# Altium schematic sheet Sheet1.SchDoc
size A4
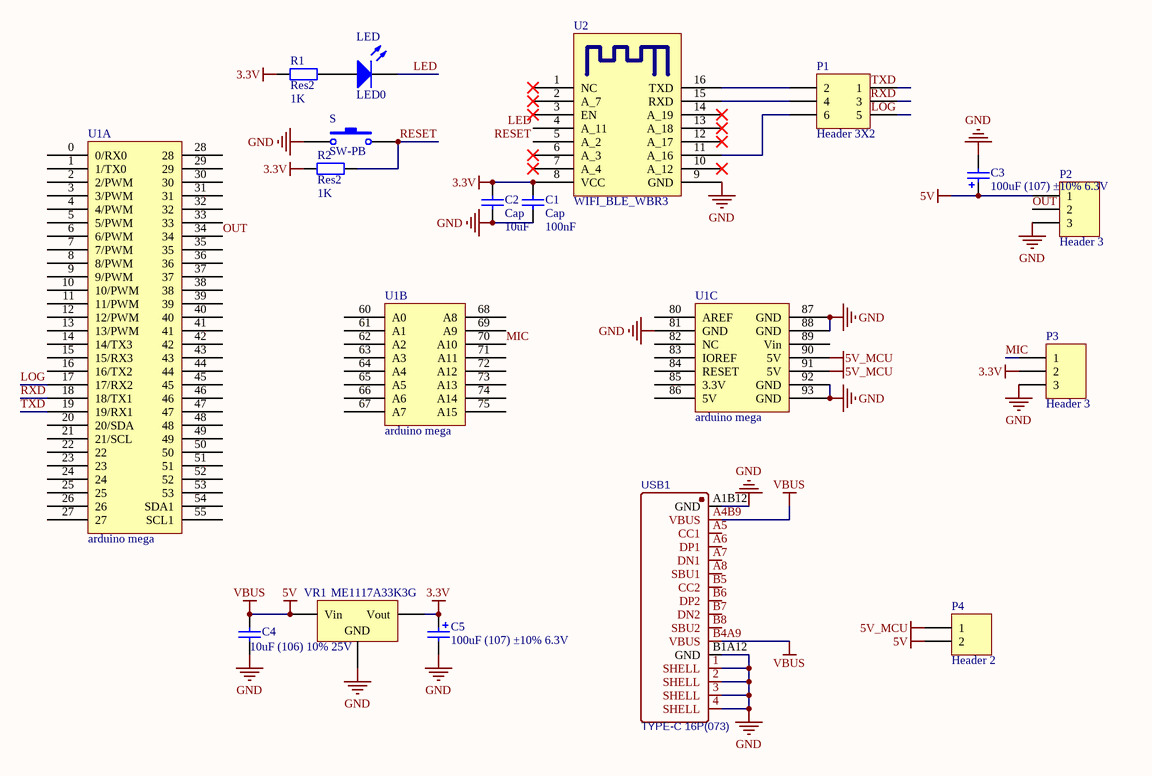
[diagram p0: Sheet1.SchDoc]

## Parts
C1  Cap  value 100nF  [C 0603_L]
C2  Cap  value 10uF  [C 0805_L]
C3  100uF (107) ±10% 6.3V  [CASE-B_3528]
C4  10uF (106) 10% 25V  [C 0805_L]
C5  100uF (107) ±10% 6.3V  [CASE-B_3528]
LED  LED0  [0603_LED_S1]
P1  Header 3X2  [HDR2X3]
P2  Header 3  [HDR1X3]
P3  Header 3  [HDR1X3]
P4  Header 2  [HDR1X2]
R1  Res2  value 1K  [R 0603_L]
R2  Res2  value 1K  [R 0603_L]
S  SW-PB  [TSW SMD-3*6*2.5]
U1  arduino mega  [arduino mega]  (parts A,B,C of 3)
U2  WIFI_BLE_WBR3  [WBR3]
USB1  TYPE-C 16P(073)  [USB-C-SMD_TYPE-C16PIN]
VR1  ME1117A33K3G  [TO-252]

## Nets
3.3V: C1.2 C2.2 C5.1 P3.2 R1.1 R2.1 U2.8(VCC) VR1.2(Vout)
5V: C3.1 C4.2 P2.1 P4.2 USB1.A4B9(VBUS) USB1.B4A9(VBUS) VR1.3(Vin)  [also labelled VBUS]
5V_MCU: P4.1 U1.90(5V) U1.91(5V)
GND: C1.1 C2.1 C3.2 C4.1 C5.2 P2.3 P3.3 S.1 U1.81(GND) U1.87(GND) U1.88(GND) U1.92(GND) U1.93(GND) U2.9(GND) USB1.1(SHELL) USB1.2(SHELL) USB1.3(SHELL) USB1.4(SHELL) USB1.A1B12(GND) USB1.B1A12(GND) VR1.1(GND)
LED: LED.2(K) U2.4(A_11)
LOG: P1.5 U1.17(17/RX2)
MIC: P3.1 U1.70(A10)
OUT: P2.2 U1.34
RESET: R2.2 S.2 U2.5(A_2)
RXD: P1.3 U1.18(18/TX1)
TXD: P1.1 U1.19(19/RX1)
NetLED_1: LED.1(A) R1.2
NetP1_2: P1.2 U2.16(TXD)
NetP1_4: P1.4 U2.15(RXD)
NetP1_6: P1.6 U2.11(A_16)

Not connected (* = marked no-connect by the designer): U1 0(0/RX0) 1(1/TX0) 2(2/PWM) 3(3/PWM) 4(4/PWM) 5(5/PWM) 6(6/PWM) 7(7/PWM) 8(8/PWM) 9(9/PWM) 10(10/PWM) 11(11/PWM) 12(12/PWM) 13(13/PWM) 14(14/TX3) 15(15/RX3) 16(16/TX2) 20(20/SDA) 21(21/SCL) 22 23 24 25 26 27 28 29 30 31 32 33 35 36 37 38 39 40 41 42 43 44 45 46 47 48 49 50 51 52 53 54(SDA1) 55(SCL1) 60(A0) 61(A1) 62(A2) 63(A3) 64(A4) 65(A5) 66(A6) 67(A7) 68(A8) 69(A9) 71(A11) 72(A12) 73(A13) 74(A14) 75(A15) 80(AREF) 82(NC) 83(IOREF) 84(RESET) 85(3.3V) 86(5V) 89(Vin); U2 1(NC)* 2(A_7)* 3(EN)* 6(A_3)* 7(A_4)* 10(A_12)* 12(A_17)* 13(A_18)* 14(A_19)*; USB1 A5(CC1) A6(DP1) A7(DN1) A8(SBU1) B5(CC2) B6(DP2) B7(DN2) B8(SBU2)

## Library data of the parts
C1 C2 = Cap: Capacitor; Published: 8-Jun-2000; LatestRevisionDate: 17-Jul-2002; LatestRevisionNote: Re-released for DXP Platform.; PackageReference: RAD-0.3; Publisher: Altium Limited; PackageDescription: Radial Cap, Thru-Hole; 2 Leads; 0.3 in Pin Spacing
C3 C5 = 3528 100uF (107) 10% 6.3V: 钽电容; ComponentLink1Description: 供应商链接; ComponentLink1URL: http://www.szlcsc.com/product/details_16815.html; Package: 3528; Supplier: LC; SuppliersPartNumber: C16133
C4 = 0805 10uF (106) 10% 25V: 贴片电容; ComponentLink1Description: 供应商链接; ComponentLink1URL: http://www.szlcsc.com/product/details_16532.html; Package: 0805; Supplier: LC; SuppliersPartNumber: C15850
LED = LED0: Typical INFRARED GaAs LED; pin to pad: 1>A 2>K; Published: 8-Jun-2000; LatestRevisionDate: 08-Jul-2005; LatestRevisionNote: Mech Layer 1 removed.; PackageReference: LED-0; Publisher: Altium Limited; PackageDescription: LED; 2 Leads
P1 = Header 3X2: Header, 3-Pin, Dual row; LatestRevisionDate: 17-Jul-2002; LatestRevisionNote: Re-released for DXP Platform.; Publisher: Altium Limited
P2 P3 = Header 3: Header, 3-Pin; LatestRevisionDate: 17-Jul-2002; LatestRevisionNote: Re-released for DXP Platform.; Publisher: Altium Limited
P4 = Header 2: Header, 2-Pin; LatestRevisionDate: 17-Jul-2002; LatestRevisionNote: Re-released for DXP Platform.; Publisher: Altium Limited
R1 R2 = Res2: Resistor; Published: 8-Jun-2000; LatestRevisionDate: 17-Jul-2002; LatestRevisionNote: Re-released for DXP Platform.; PackageReference: AXIAL-0.4; Publisher: Altium Limited; PackageDescription: Axial Device, Thru-Hole; 2 Leads; 0.4 in Pin Spacing
S = SW-PB: Switch; Published: 24-Mar-1999; LatestRevisionDate: 17-Jul-2002; LatestRevisionNote: Re-released for DXP Platform.; PackageReference: SPST-2; Publisher: Altium Limited; PackageDescription: Switch; 2 Leads
U2 = WBR3: Module
USB1 = TYPE-C 16P(073): BOM_Manufacturer: SHOU HAN; Contributor: LCSC; BOM_Supplier: LCSC; BOM_Supplier Part: C668624; BOM_Manufacturer Part: TYPE-C 16P(073); spicePre: U; spiceSymbolName: TYPE-C 16P(073)
VR1 = SOT-223 AMS1117-3.3: 低压差线性稳压(LDO); ComponentLink1Description: 供应商链接; ComponentLink1URL: https://item.szlcsc.com/421848.html; Package: SOT-223; Supplier: LC; SuppliersPartNumber: C427608